# EAGLE schematic memory (EAGLE 9.5.2)
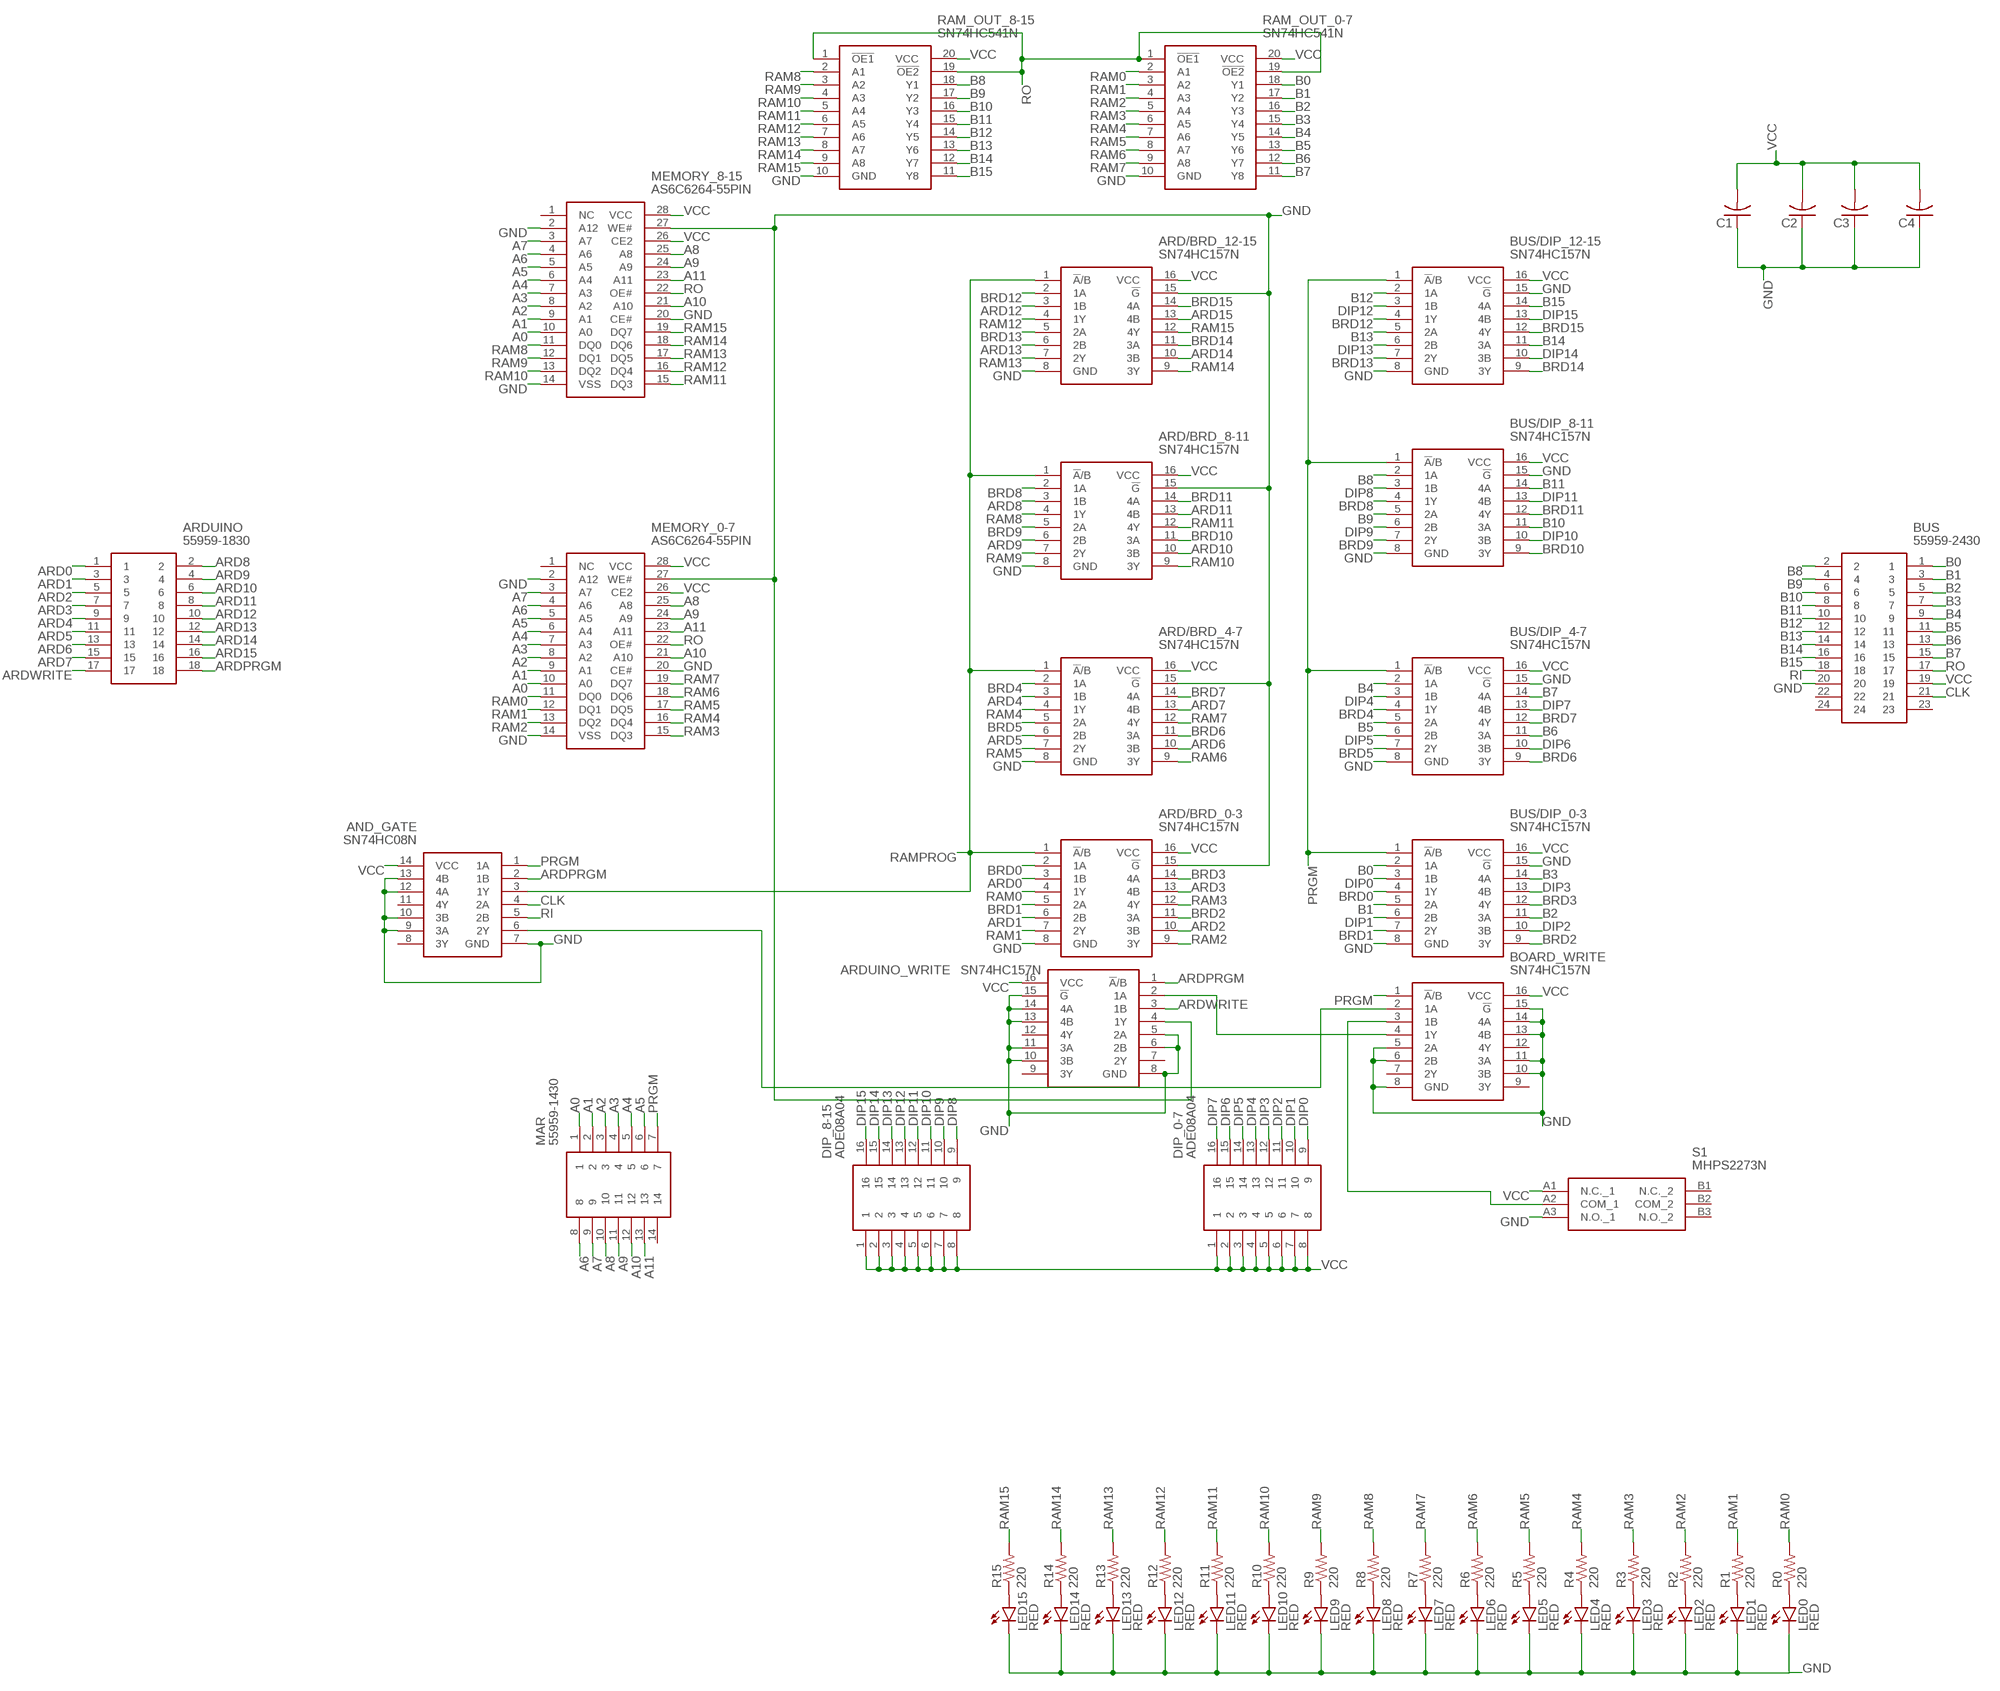
[diagram p0: schematic, sheet 1]

## Parts
AND_GATE  SN74HC08N  [DIP794W53P254L1930H508Q14N]
ARD/BRD_0-3  SN74HC157N  [DIP794W53P254L1930H508Q16N]
ARD/BRD_4-7  SN74HC157N  [DIP794W53P254L1930H508Q16N]
ARD/BRD_8-11  SN74HC157N  [DIP794W53P254L1930H508Q16N]
ARD/BRD_12-15  SN74HC157N  [DIP794W53P254L1930H508Q16N]
ARDUINO  55959-1830  [SHDR18W65P250X200_2X9_2140X140]
ARDUINO_WRITE  SN74HC157N  [DIP794W53P254L1930H508Q16N]
BOARD_WRITE  SN74HC157N  [DIP794W53P254L1930H508Q16N]
BUS  55959-2430  [559592430]
BUS/DIP_0-3  SN74HC157N  [DIP794W53P254L1930H508Q16N]
BUS/DIP_4-7  SN74HC157N  [DIP794W53P254L1930H508Q16N]
BUS/DIP_8-11  SN74HC157N  [DIP794W53P254L1930H508Q16N]
BUS/DIP_12-15  SN74HC157N  [DIP794W53P254L1930H508Q16N]
C1  C-US025-024X044  [C025-024X044]
C2  C-US025-024X044  [C025-024X044]
C3  C-US025-024X044  [C025-024X044]
C4  C-US025-024X044  [C025-024X044]
DIP_0-7  ADE08A04  [DIP810W60P254L2225H590Q16N]
DIP_8-15  ADE08A04  [DIP810W60P254L2225H590Q16N]
LED0  RED  LED3MM  [LED3MM]
LED1  RED  LED3MM  [LED3MM]
LED2  RED  LED3MM  [LED3MM]
LED3  RED  LED3MM  [LED3MM]
LED4  RED  LED3MM  [LED3MM]
LED5  RED  LED3MM  [LED3MM]
LED6  RED  LED3MM  [LED3MM]
LED7  RED  LED3MM  [LED3MM]
LED8  RED  LED3MM  [LED3MM]
LED9  RED  LED3MM  [LED3MM]
LED10  RED  LED3MM  [LED3MM]
LED11  RED  LED3MM  [LED3MM]
LED12  RED  LED3MM  [LED3MM]
LED13  RED  LED3MM  [LED3MM]
LED14  RED  LED3MM  [LED3MM]
LED15  RED  LED3MM  [LED3MM]
MAR  55959-1430  [559591430]
MEMORY_0-7  AS6C6264-55PIN  [DIP1524W51P254L3632H394Q28N]
MEMORY_8-15  AS6C6264-55PIN  [DIP1524W51P254L3632H394Q28N]
R0  220  R-US_0204/7  [0204/7]
R1  220  R-US_0204/7  [0204/7]
R2  220  R-US_0204/7  [0204/7]
R3  220  R-US_0204/7  [0204/7]
R4  220  R-US_0204/7  [0204/7]
R5  220  R-US_0204/7  [0204/7]
R6  220  R-US_0204/7  [0204/7]
R7  220  R-US_0204/7  [0204/7]
R8  220  R-US_0204/7  [0204/7]
R9  220  R-US_0204/7  [0204/7]
R10  220  R-US_0204/7  [0204/7]
R11  220  R-US_0204/7  [0204/7]
R12  220  R-US_0204/7  [0204/7]
R13  220  R-US_0204/7  [0204/7]
R14  220  R-US_0204/7  [0204/7]
R15  220  R-US_0204/7  [0204/7]
RAM_OUT_0-7  SN74HC541N  [DIP794W53P254L2540H508Q20N]
RAM_OUT_8-15  SN74HC541N  [DIP794W53P254L2540H508Q20N]
S1  MHPS2273N  [MHPS2273N]

## Nets
A0: MAR.1 MEMORY_0-7.10(A0) MEMORY_8-15.10(A0)
A1: MAR.2 MEMORY_0-7.9(A1) MEMORY_8-15.9(A1)
A2: MAR.3 MEMORY_0-7.8(A2) MEMORY_8-15.8(A2)
A3: MAR.4 MEMORY_0-7.7(A3) MEMORY_8-15.7(A3)
A4: MAR.5 MEMORY_0-7.6(A4) MEMORY_8-15.6(A4)
A5: MAR.6 MEMORY_0-7.5(A5) MEMORY_8-15.5(A5)
A6: MAR.8 MEMORY_0-7.4(A6) MEMORY_8-15.4(A6)
A7: MAR.9 MEMORY_0-7.3(A7) MEMORY_8-15.3(A7)
A8: MAR.10 MEMORY_0-7.25(A8) MEMORY_8-15.25(A8)
A9: MAR.11 MEMORY_0-7.24(A9) MEMORY_8-15.24(A9)
A10: MAR.12 MEMORY_0-7.21(A10) MEMORY_8-15.21(A10)
A11: MAR.13 MEMORY_0-7.23(A11) MEMORY_8-15.23(A11)
ARD0: ARD/BRD_0-3.3(1B) ARDUINO.1
ARD1: ARD/BRD_0-3.6(2B) ARDUINO.3
ARD2: ARD/BRD_0-3.10(3B) ARDUINO.5
ARD3: ARD/BRD_0-3.13(4B) ARDUINO.7
ARD4: ARD/BRD_4-7.3(1B) ARDUINO.9
ARD5: ARD/BRD_4-7.6(2B) ARDUINO.11
ARD6: ARD/BRD_4-7.10(3B) ARDUINO.13
ARD7: ARD/BRD_4-7.13(4B) ARDUINO.15
ARD8: ARD/BRD_8-11.3(1B) ARDUINO.2
ARD9: ARD/BRD_8-11.6(2B) ARDUINO.4
ARD10: ARD/BRD_8-11.10(3B) ARDUINO.6
ARD11: ARD/BRD_8-11.13(4B) ARDUINO.8
ARD12: ARD/BRD_12-15.3(1B) ARDUINO.10
ARD13: ARD/BRD_12-15.6(2B) ARDUINO.12
ARD14: ARD/BRD_12-15.10(3B) ARDUINO.14
ARD15: ARD/BRD_12-15.13(4B) ARDUINO.16
ARDPRGM: AND_GATE.2(1B) ARDUINO.18 ARDUINO_WRITE.1(!A!/B)
ARDWRITE: ARDUINO.17 ARDUINO_WRITE.3(1B)
B0: BUS.1 BUS/DIP_0-3.2(1A) RAM_OUT_0-7.18(Y1)
B1: BUS.3 BUS/DIP_0-3.5(2A) RAM_OUT_0-7.17(Y2)
B2: BUS.5 BUS/DIP_0-3.11(3A) RAM_OUT_0-7.16(Y3)
B3: BUS.7 BUS/DIP_0-3.14(4A) RAM_OUT_0-7.15(Y4)
B4: BUS.9 BUS/DIP_4-7.2(1A) RAM_OUT_0-7.14(Y5)
B5: BUS.11 BUS/DIP_4-7.5(2A) RAM_OUT_0-7.13(Y6)
B6: BUS.13 BUS/DIP_4-7.11(3A) RAM_OUT_0-7.12(Y7)
B7: BUS.15 BUS/DIP_4-7.14(4A) RAM_OUT_0-7.11(Y8)
B8: BUS.2 BUS/DIP_8-11.2(1A) RAM_OUT_8-15.18(Y1)
B9: BUS.4 BUS/DIP_8-11.5(2A) RAM_OUT_8-15.17(Y2)
B10: BUS.6 BUS/DIP_8-11.11(3A) RAM_OUT_8-15.16(Y3)
B11: BUS.8 BUS/DIP_8-11.14(4A) RAM_OUT_8-15.15(Y4)
B12: BUS.10 BUS/DIP_12-15.2(1A) RAM_OUT_8-15.14(Y5)
B13: BUS.12 BUS/DIP_12-15.5(2A) RAM_OUT_8-15.13(Y6)
B14: BUS.14 BUS/DIP_12-15.11(3A) RAM_OUT_8-15.12(Y7)
B15: BUS.16 BUS/DIP_12-15.14(4A) RAM_OUT_8-15.11(Y8)
BRD0: ARD/BRD_0-3.2(1A) BUS/DIP_0-3.4(1Y)
BRD1: ARD/BRD_0-3.5(2A) BUS/DIP_0-3.7(2Y)
BRD2: ARD/BRD_0-3.11(3A) BUS/DIP_0-3.9(3Y)
BRD3: ARD/BRD_0-3.14(4A) BUS/DIP_0-3.12(4Y)
BRD4: ARD/BRD_4-7.2(1A) BUS/DIP_4-7.4(1Y)
BRD5: ARD/BRD_4-7.5(2A) BUS/DIP_4-7.7(2Y)
BRD6: ARD/BRD_4-7.11(3A) BUS/DIP_4-7.9(3Y)
BRD7: ARD/BRD_4-7.14(4A) BUS/DIP_4-7.12(4Y)
BRD8: ARD/BRD_8-11.2(1A) BUS/DIP_8-11.4(1Y)
BRD9: ARD/BRD_8-11.5(2A) BUS/DIP_8-11.7(2Y)
BRD10: ARD/BRD_8-11.11(3A) BUS/DIP_8-11.9(3Y)
BRD11: ARD/BRD_8-11.14(4A) BUS/DIP_8-11.12(4Y)
BRD12: ARD/BRD_12-15.2(1A) BUS/DIP_12-15.4(1Y)
BRD13: ARD/BRD_12-15.5(2A) BUS/DIP_12-15.7(2Y)
BRD14: ARD/BRD_12-15.11(3A) BUS/DIP_12-15.9(3Y)
BRD15: ARD/BRD_12-15.14(4A) BUS/DIP_12-15.12(4Y)
CLK: AND_GATE.4(2A) BUS.21
DIP0: BUS/DIP_0-3.3(1B) DIP_0-7.9
DIP1: BUS/DIP_0-3.6(2B) DIP_0-7.10
DIP2: BUS/DIP_0-3.10(3B) DIP_0-7.11
DIP3: BUS/DIP_0-3.13(4B) DIP_0-7.12
DIP4: BUS/DIP_4-7.3(1B) DIP_0-7.13
DIP5: BUS/DIP_4-7.6(2B) DIP_0-7.14
DIP6: BUS/DIP_4-7.10(3B) DIP_0-7.15
DIP7: BUS/DIP_4-7.13(4B) DIP_0-7.16
DIP8: BUS/DIP_8-11.3(1B) DIP_8-15.9
DIP9: BUS/DIP_8-11.6(2B) DIP_8-15.10
DIP10: BUS/DIP_8-11.10(3B) DIP_8-15.11
DIP11: BUS/DIP_8-11.13(4B) DIP_8-15.12
DIP12: BUS/DIP_12-15.3(1B) DIP_8-15.13
DIP13: BUS/DIP_12-15.6(2B) DIP_8-15.14
DIP14: BUS/DIP_12-15.10(3B) DIP_8-15.15
DIP15: BUS/DIP_12-15.13(4B) DIP_8-15.16
GND: AND_GATE.7(GND) AND_GATE.9(3A) AND_GATE.10(3B) AND_GATE.12(4A) AND_GATE.13(4B) ARD/BRD_0-3.8(GND) ARD/BRD_0-3.15(!G) ARD/BRD_4-7.8(GND) ARD/BRD_4-7.15(!G) ARD/BRD_8-11.8(GND) ARD/BRD_8-11.15(!G) ARD/BRD_12-15.8(GND) ARD/BRD_12-15.15(!G) ARDUINO_WRITE.4(1Y) ARDUINO_WRITE.5(2A) ARDUINO_WRITE.6(2B) ARDUINO_WRITE.8(GND) ARDUINO_WRITE.10(3B) ARDUINO_WRITE.11(3A) ARDUINO_WRITE.13(4B) ARDUINO_WRITE.14(4A) ARDUINO_WRITE.15(!G) BOARD_WRITE.5(2A) BOARD_WRITE.6(2B) BOARD_WRITE.8(GND) BOARD_WRITE.10(3B) BOARD_WRITE.11(3A) BOARD_WRITE.13(4B) BOARD_WRITE.14(4A) BOARD_WRITE.15(!G) BUS.20 BUS/DIP_0-3.8(GND) BUS/DIP_0-3.15(!G) BUS/DIP_4-7.8(GND) BUS/DIP_4-7.15(!G) BUS/DIP_8-11.8(GND) BUS/DIP_8-11.15(!G) BUS/DIP_12-15.8(GND) BUS/DIP_12-15.15(!G) C1.1 C2.1 C3.1 C4.1 LED0.K(C) LED1.K(C) LED2.K(C) LED3.K(C) LED4.K(C) LED5.K(C) LED6.K(C) LED7.K(C) LED8.K(C) LED9.K(C) LED10.K(C) LED11.K(C) LED12.K(C) LED13.K(C) LED14.K(C) LED15.K(C) MEMORY_0-7.2(A12) MEMORY_0-7.14(VSS) MEMORY_0-7.20(CE#) MEMORY_0-7.27(WE#) MEMORY_8-15.2(A12) MEMORY_8-15.14(VSS) MEMORY_8-15.20(CE#) MEMORY_8-15.27(WE#) RAM_OUT_0-7.10(GND) RAM_OUT_8-15.10(GND) S1.A3(N.O._1)
N$1: LED1.A R1.1
N$2: BOARD_WRITE.3(1B) S1.A2(COM_1)
N$3: ARDUINO_WRITE.2(1A) BOARD_WRITE.4(1Y)
N$4: LED2.A R2.1
N$5: LED3.A R3.1
N$6: LED4.A R4.1
N$7: LED5.A R5.1
N$8: LED6.A R6.1
N$9: LED7.A R7.1
N$10: LED8.A R8.1
N$11: LED9.A R9.1
N$12: LED10.A R10.1
N$13: LED11.A R11.1
N$14: LED12.A R12.1
N$15: LED13.A R13.1
N$16: LED14.A R14.1
N$17: LED15.A R15.1
N$18: LED0.A R0.1
PRGM: AND_GATE.1(1A) BOARD_WRITE.1(!A!/B) BUS/DIP_0-3.1(!A!/B) BUS/DIP_4-7.1(!A!/B) BUS/DIP_8-11.1(!A!/B) BUS/DIP_12-15.1(!A!/B) MAR.7
RAM0: ARD/BRD_0-3.4(1Y) MEMORY_0-7.11(DQ0) R0.2 RAM_OUT_0-7.2(A1)
RAM1: ARD/BRD_0-3.7(2Y) MEMORY_0-7.12(DQ1) R1.2 RAM_OUT_0-7.3(A2)
RAM2: ARD/BRD_0-3.9(3Y) MEMORY_0-7.13(DQ2) R2.2 RAM_OUT_0-7.4(A3)
RAM3: ARD/BRD_0-3.12(4Y) MEMORY_0-7.15(DQ3) R3.2 RAM_OUT_0-7.5(A4)
RAM4: ARD/BRD_4-7.4(1Y) MEMORY_0-7.16(DQ4) R4.2 RAM_OUT_0-7.6(A5)
RAM5: ARD/BRD_4-7.7(2Y) MEMORY_0-7.17(DQ5) R5.2 RAM_OUT_0-7.7(A6)
RAM6: ARD/BRD_4-7.9(3Y) MEMORY_0-7.18(DQ6) R6.2 RAM_OUT_0-7.8(A7)
RAM7: ARD/BRD_4-7.12(4Y) MEMORY_0-7.19(DQ7) R7.2 RAM_OUT_0-7.9(A8)
RAM8: ARD/BRD_8-11.4(1Y) MEMORY_8-15.11(DQ0) R8.2 RAM_OUT_8-15.2(A1)
RAM9: ARD/BRD_8-11.7(2Y) MEMORY_8-15.12(DQ1) R9.2 RAM_OUT_8-15.3(A2)
RAM10: ARD/BRD_8-11.9(3Y) MEMORY_8-15.13(DQ2) R10.2 RAM_OUT_8-15.4(A3)
RAM11: ARD/BRD_8-11.12(4Y) MEMORY_8-15.15(DQ3) R11.2 RAM_OUT_8-15.5(A4)
RAM12: ARD/BRD_12-15.4(1Y) MEMORY_8-15.16(DQ4) R12.2 RAM_OUT_8-15.6(A5)
RAM13: ARD/BRD_12-15.7(2Y) MEMORY_8-15.17(DQ5) R13.2 RAM_OUT_8-15.7(A6)
RAM14: ARD/BRD_12-15.9(3Y) MEMORY_8-15.18(DQ6) R14.2 RAM_OUT_8-15.8(A7)
RAM15: ARD/BRD_12-15.12(4Y) MEMORY_8-15.19(DQ7) R15.2 RAM_OUT_8-15.9(A8)
RAMCLK: AND_GATE.6(2Y) BOARD_WRITE.2(1A)
RAMPROG: AND_GATE.3(1Y) ARD/BRD_0-3.1(!A!/B) ARD/BRD_4-7.1(!A!/B) ARD/BRD_8-11.1(!A!/B) ARD/BRD_12-15.1(!A!/B)
RI: AND_GATE.5(2B) BUS.18
RO: BUS.17 MEMORY_0-7.22(OE#) MEMORY_8-15.22(OE#) RAM_OUT_0-7.1(!OE1) RAM_OUT_0-7.19(!OE2) RAM_OUT_8-15.1(!OE1) RAM_OUT_8-15.19(!OE2)
VCC: AND_GATE.14(VCC) ARD/BRD_0-3.16(VCC) ARD/BRD_4-7.16(VCC) ARD/BRD_8-11.16(VCC) ARD/BRD_12-15.16(VCC) ARDUINO_WRITE.16(VCC) BOARD_WRITE.16(VCC) BUS.19 BUS/DIP_0-3.16(VCC) BUS/DIP_4-7.16(VCC) BUS/DIP_8-11.16(VCC) BUS/DIP_12-15.16(VCC) C1.2 C2.2 C3.2 C4.2 DIP_0-7.1 DIP_0-7.2 DIP_0-7.3 DIP_0-7.4 DIP_0-7.5 DIP_0-7.6 DIP_0-7.7 DIP_0-7.8 DIP_8-15.1 DIP_8-15.2 DIP_8-15.3 DIP_8-15.4 DIP_8-15.5 DIP_8-15.6 DIP_8-15.7 DIP_8-15.8 MEMORY_0-7.26(CE2) MEMORY_0-7.28(VCC) MEMORY_8-15.26(CE2) MEMORY_8-15.28(VCC) RAM_OUT_0-7.20(VCC) RAM_OUT_8-15.20(VCC) S1.A1(N.C._1)
Unconnected: AND_GATE.8(3Y) AND_GATE.11(4Y) ARDUINO_WRITE.7(2Y) ARDUINO_WRITE.9(3Y) ARDUINO_WRITE.12(4Y) BOARD_WRITE.7(2Y) BOARD_WRITE.9(3Y) BOARD_WRITE.12(4Y) BUS.22 BUS.23 BUS.24 MAR.14 MEMORY_0-7.1(NC) MEMORY_8-15.1(NC) S1.B1(N.C._2) S1.B2(COM_2) S1.B3(N.O._2)

## Library data of the parts
AND_GATE = SamacSys_Parts:SN74HC08N: QUADRUPLE 2-INPUT POSITIVE-NOR GATES Source: Datasheet <http://componentsearchengine.com/Datasheets/1/SN74HC08N.pdf>; DESCRIPTION: QUADRUPLE 2-INPUT POSITIVE-NOR GATES; HEIGHT: 5.08mm; MANUFACTURER_NAME: Texas Instruments; MANUFACTURER_PART_NUMBER: SN74HC08N; MOUSER_PART_NUMBER: 595-SN74HC08N; MOUSER_PRICE-STOCK: https://www.mouser.com/Search/Refine.aspx?Keyword=595-SN74HC08N
ARD/BRD_0-3 ARD/BRD_4-7 ARD/BRD_8-11 ARD/BRD_12-15 ARDUINO_WRITE BOARD_WRITE BUS/DIP_0-3 BUS/DIP_4-7 BUS/DIP_8-11 BUS/DIP_12-15 = SamacSys_Parts:SN74HC157N: Quadruple 2-Line To 1-Line Data Selectors/Multiplexers Source: Datasheet <http://www.ti.com/lit/gpn/sn74hc157>; DESCRIPTION: Quadruple 2-Line To 1-Line Data Selectors/Multiplexers; HEIGHT: 5.08mm; MANUFACTURER_NAME: Texas Instruments; MANUFACTURER_PART_NUMBER: SN74HC157N; MOUSER_PART_NUMBER: 595-SN74HC157N; MOUSER_PRICE-STOCK: https://www.mouser.com/Search/Refine.aspx?Keyword=595-SN74HC157N
ARDUINO = SamacSys_Parts:55959-1830: Molex MICROCLASP Series, Series Number 55959, 2mm Pitch 18 Way 2 Row Right Angle PCB Header, Solder Termination, 3A Source: Datasheet <https://componentsearchengine.com/Datasheets/1/55959-1830.pdf>; DESCRIPTION: Molex MICROCLASP Series, Series Number 55959, 2mm Pitch 18 Way 2 Row Right Angle PCB Header, Solder Termination, 3A; HEIGHT: 11.7mm; MANUFACTURER_NAME: Molex; MANUFACTURER_PART_NUMBER: 55959-1830; MOUSER_PART_NUMBER: 538-55959-1830; MOUSER_PRICE-STOCK: https://www.mouser.com/Search/Refine.aspx?Keyword=538-55959-1830
BUS = SamacSys_Parts:55959-2430: Headers & Wire Housings 24 Ckt R.A. Header Source: Datasheet <https://componentsearchengine.com/Datasheets/1/55959-2430.pdf>; DESCRIPTION: Headers & Wire Housings 24 Ckt R.A. Header; HEIGHT: 11.95mm; MANUFACTURER_NAME: Molex; MANUFACTURER_PART_NUMBER: 55959-2430; MOUSER_PART_NUMBER: 538-55959-2430; MOUSER_PRICE-STOCK: https://www.mouser.com/Search/Refine.aspx?Keyword=538-55959-2430
C1-C4 = rcl:C-US: CAPACITOR, American symbol; SPICEPREFIX: C
DIP_0-7 DIP_8-15 = SamacSys_Parts:ADE08A04: 8 Way Through Hole DIP Switch SPST, Extended Slide Actuator Source: Datasheet <https://componentsearchengine.com/Datasheets/1/ADE08A04.pdf>; DESCRIPTION: 8 Way Through Hole DIP Switch SPST, Extended Slide Actuator; HEIGHT: 5.9mm; MANUFACTURER_NAME: TE Connectivity; MANUFACTURER_PART_NUMBER: ADE08A04; MOUSER_PART_NUMBER: 506-ADE08A04; MOUSER_PRICE-STOCK: https://www.mouser.com/Search/Refine.aspx?Keyword=506-ADE08A04
LED0 LED1-LED15 = led:LED: LED OSRAM: - CHIPLED LG R971, LG N971, LY N971, LG Q971, LY Q971, LO R971, LY R971 LH N974, LH R974 LS Q976, LO Q976, LY Q976 LO Q996 - Hyper CHIPLED LW Q18S LB Q993, LB Q99A, LB R99A - SideLED LS A670, LO A670, LY A670, LG A670, LP A670 LB A673, LV A673, LT A673, LW A673 LH A674 LY A675 LS A676, LA A676, LO A676, LY A676, LW A676 LS A679, LY A679, LG A679 - Hyper Micro SIDELED® LS Y876, LA Y876, LO Y876, LY Y876 LT Y87S - SmartLED LW L88C, LW L88S LB L89C, LB L89S, LG L890 LS L89K, LO L89K, LY L89K LS L896, LA L896, LO L896, LY L896 - TOPLED LS T670, LO T670, LY T670, LG T670, LP T670 LSG T670, LSP T670, LSY T670, LOP T670, LYG T670 LG T671, LOG T671, LSG T671 LB T673, LV T673, LT T673, LW T673 LH T674 LS T676, LA T676, LO T676, LY T676, LB T676, LH T676, LSB T676, LW T676 LB T67C, LV T67C, LT T67C, LS T67K, LO T67K, LY T67K, LW E67C LS E67B, LA E67B, LO E67B, LY E67B, LB E67C, LV E67C, LT E67C LW T67C LS T679, LY T679, LG T679 LS T770, LO T770, LY T770, LG T770, LP T770 LB T773, LV T773, LT T773, LW T773 LH T774 LS E675, LA E675, LY E675, LS T675 LS T776, LA T776, LO T776, LY T776, LB T776 LHGB T686 LT T68C, LB T68C - Hyper Mini TOPLED® LB M676 - Mini TOPLED Santana® LG M470 LS M47K, LO M47K, LY M47K Source: http://www.osram.convergy.de LUXEON: - LUMILED® LXK2-PW12-R00, LXK2-PW12-S00, LXK2-PW14-U00, LXK2-PW14-V00 LXK2-PM12-R00, LXK2-PM12-S00, LXK2-PM14-U00 LXK2-PE12-Q00, LXK2-PE12-R00, LXK2-PE12-S00, LXK2-PE14-T00, LXK2-PE14-U00 LXK2-PB12-K00, LXK2-PB12-L00, LXK2-PB12-M00, LXK2-PB14-N00, LXK2-PB14-P00, LXK2-PB14-Q00 LXK2-PR12-L00, LXK2-PR12-M00, LXK2-PR14-Q00, LXK2-PR14-R00 LXK2-PD12-Q00, LXK2-PD12-R00, LXK2-PD12-S00 LXK2-PH12-R00, LXK2-PH12-S00 LXK2-PL12-P00, LXK2-PL12-Q00, LXK2-PL12-R00 Source: www.luxeon.com KINGBRIGHT: KA-3528ASYC Source: www.kingbright.com
MAR = SamacSys_Parts:55959-1430: Molex MICROCLASP 55959, 2mm Pitch, 14 Way, 2 Row, Right Angle PCB Header, Through Hole Source: Datasheet <https://componentsearchengine.com/Datasheets/1/55959-1430.pdf>; DESCRIPTION: Molex MICROCLASP 55959, 2mm Pitch, 14 Way, 2 Row, Right Angle PCB Header, Through Hole; HEIGHT: 11.7mm; MANUFACTURER_NAME: Molex; MANUFACTURER_PART_NUMBER: 55959-1430; MOUSER_PART_NUMBER: 538-55959-1430; MOUSER_PRICE-STOCK: https://www.mouser.com/Search/Refine.aspx?Keyword=538-55959-1430
MEMORY_0-7 MEMORY_8-15 = SamacSys_Parts:AS6C6264-55PIN: SRAM 64K, 2.7-5.5V, 55ns 8K x 8 CMOS SRAM Source: Datasheet <https://componentsearchengine.com/Datasheets/1/AS6C6264-55PIN.pdf>; DESCRIPTION: SRAM 64K, 2.7-5.5V, 55ns 8K x 8 CMOS SRAM; HEIGHT: 3.937mm; MANUFACTURER_NAME: Alliance Memory; MANUFACTURER_PART_NUMBER: AS6C6264-55PIN; MOUSER_PART_NUMBER: 913-AS6C6264-55PIN; MOUSER_PRICE-STOCK: https://www.mouser.com/Search/Refine.aspx?Keyword=913-AS6C6264-55PIN
R0 R1-R15 = rcl:R-US_: RESISTOR, American symbol; SPICEPREFIX: R
RAM_OUT_0-7 RAM_OUT_8-15 = SamacSys_Parts:SN74HC541N: Octal Buffers And Line Drivers With 3-State Outputs Source: Datasheet <http://componentsearchengine.com/Datasheets/3/SN74HC541N.pdf>; DESCRIPTION: Octal Buffers And Line Drivers With 3-State Outputs; HEIGHT: 5.08mm; MANUFACTURER_NAME: Texas Instruments; MANUFACTURER_PART_NUMBER: SN74HC541N; MOUSER_PART_NUMBER: 595-SN74HC541N; MOUSER_PRICE-STOCK: https://www.mouser.com/Search/Refine.aspx?Keyword=595-SN74HC541N
S1 = SamacSys_Parts:MHPS2273N: Pushbutton Switches Momentary key DP Source: Datasheet <https://componentsearchengine.com/Datasheets/1/MHPS2273N.pdf>; DESCRIPTION: Pushbutton Switches Momentary key DP; HEIGHT: 13.5mm; MANUFACTURER_NAME: Apem; MANUFACTURER_PART_NUMBER: MHPS2273N; MOUSER_PART_NUMBER: 642-MHPS2273N; MOUSER_PRICE-STOCK: https://www.mouser.com/Search/Refine.aspx?Keyword=642-MHPS2273N